# EAGLE schematic SLOPE Undergraduate Student Instrumentation Project (USIP) (EAGLE 8.3.2)
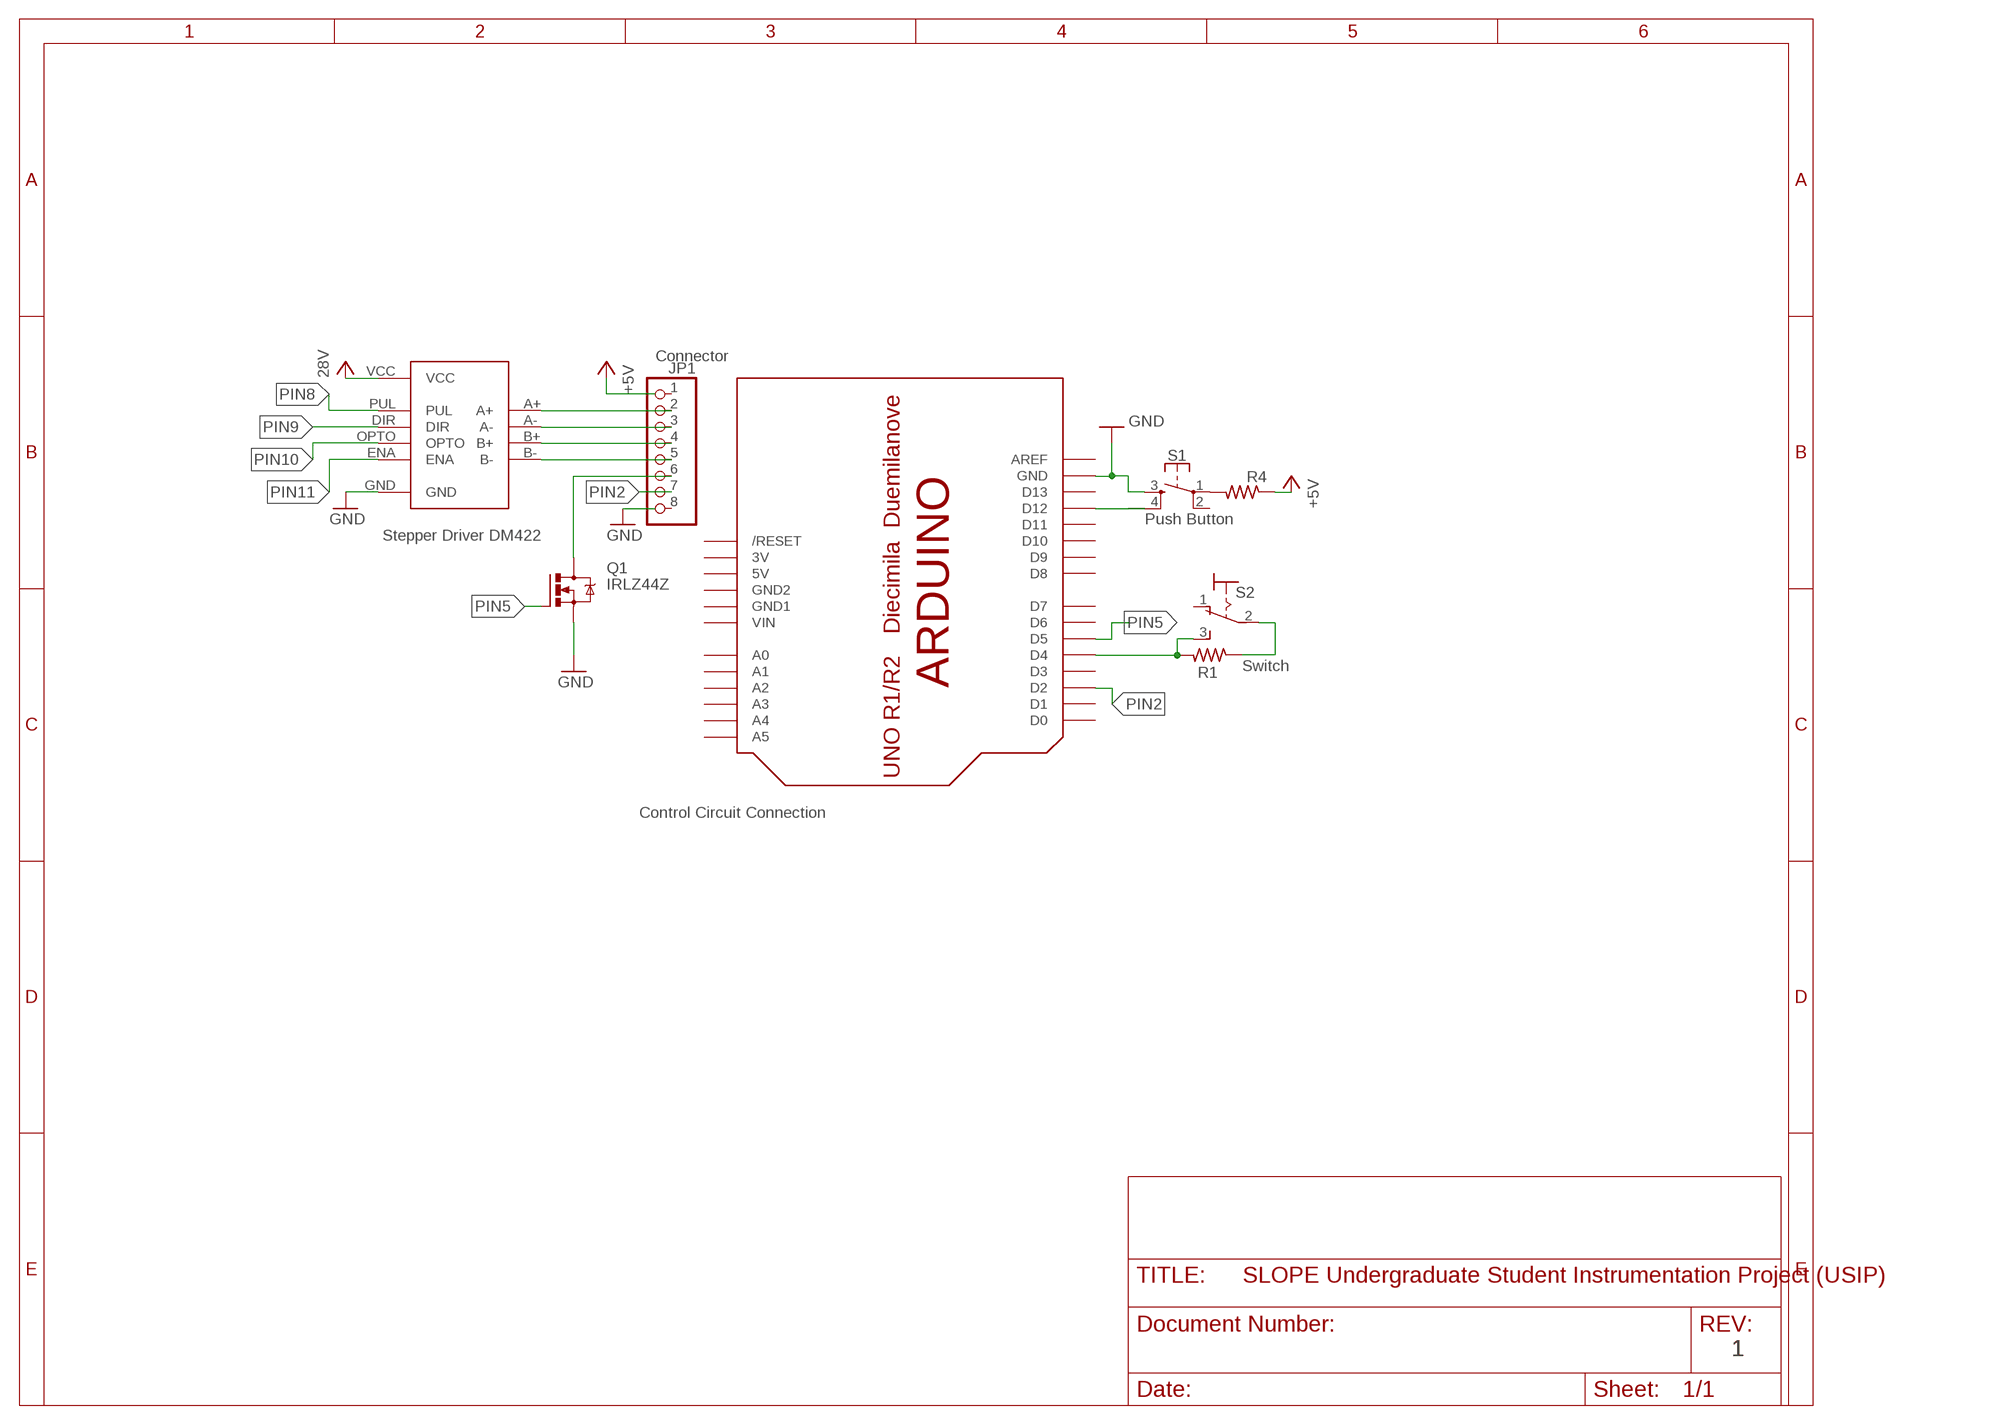
[diagram p0: schematic, sheet 1]

## Parts
JP1  PINHD-1X8  [1X08]
Q1  IRLZ44Z  [TO220BH]
R1  R-US_0204/5  [0204/5]
R4  R-US_0204/5  [0204/5]
S1  MOMENTARY-SWITCH-SPST-2-SMD-5.2MM  [TACTILE_SWITCH_SMD_5.2MM]
S2  320-916  [320-916]
U$1  ARDUINO-BPLACE  [ARDUINO-BPLACE]
U$2  DM422  [DIL14]

## Nets
+5V: R4.1
GND: Q1.S S1.3 U$1.GND U$2.GND
N$1: JP1.2 U$2.A+
N$2: R4.2 S1.1
N$3: JP1.3 U$2.A-
N$4: R1.1 S2.2(P)
N$5: JP1.4 U$2.B+
N$6: JP1.5 U$2.B-
NEG: JP1.6 Q1.D
PIN2: JP1.7 U$1.D2
PIN4: R1.2 S2.3(S) U$1.D4
PIN5: Q1.G U$1.D5
PIN8: U$2.PUL
PIN9: U$2.DIR
PIN10: U$2.OPTO
PIN11: U$2.ENA
PIN12: S1.4 U$1.D12
VCC: U$2.VCC ; supply symbol labelled 28V
Unconnected: JP1.1 JP1.8 S1.2 S2.1(O) U$1.A0 U$1.A1 U$1.A2 U$1.A3 U$1.A4 U$1.A5 U$1.AREF U$1.D0 U$1.D1 U$1.D3 U$1.D6 U$1.D7 U$1.D8 U$1.D9 U$1.D10 U$1.D11 U$1.D13 U$1.RESET(/RESET)

## Notes on the sheet
- Connector
- GND
- GND | Push Button
- GND
- Switch
- Control Circuit Connection
- 1 | 1

## Power pins joined to a net without a drawn wire
3V: U$1.3V
5V: U$1.5V
GND1: U$1.GND1
GND2: U$1.GND2
VIN: U$1.VIN

## Library data of the parts
JP1 = pinhead:PINHD-1X8: PIN HEADER
Q1 = transistor-power:IRLZ44Z: N-Channel HEXFET® Power MOSFET Logic Level AUTOMOTIVE MOSFET Source: http://www.irf.com/product-info/datasheets/data/irlz44zpbf.pdf
R1 R4 = adafruit:R-US_: RESISTOR, American symbol
S1 = SparkFun-Switches:MOMENTARY-SWITCH-SPST-2: Momentary Switch (Pushbutton) - SPST - Two Circuits Normally-open (NO) SPST momentary switches (buttons, pushbuttons). Schematic symbol includes two switch circuits. Variants SMD-4.6MMX2.8MM - 4.60mm x 2.80mm Tactile Momentary Button Switch - Used on SparkFun SAMD21 Mini Breakout <https://www.sparkfun.com/products/13664> SMD-5.2MM - Mini Pushbutton Switch - SMD <https://www.sparkfun.com/products/8720> - Used on Arduino Pro Mini <https://www.sparkfun.com/products/11114>; PROD_ID: SWCH-08247; SF_SKU: COM-08720
S2 = switch:320-916: TOGGLE SWITCH distributor RS Components
U$1 = adafruit:ARDUINO: Arduino Diecimila/Duemilanove Make a shield with ease, this package has all the named pins as well as the two mounting drill holes and an outline of the USB and DC power connector. The outline is on the DIMENSION layer, so if your board house uses it they will cut the outline to match. http://www.ladyada.net/library/pcb/eaglelibrary.html
U$2 = DM422 Stepper Driver :DM422: DM422 Stepper Driver: This is only a dummy schematic symbol to show connections to MCU.